# EAGLE schematic bluepill-knx-transceiver (EAGLE 9.0.1)
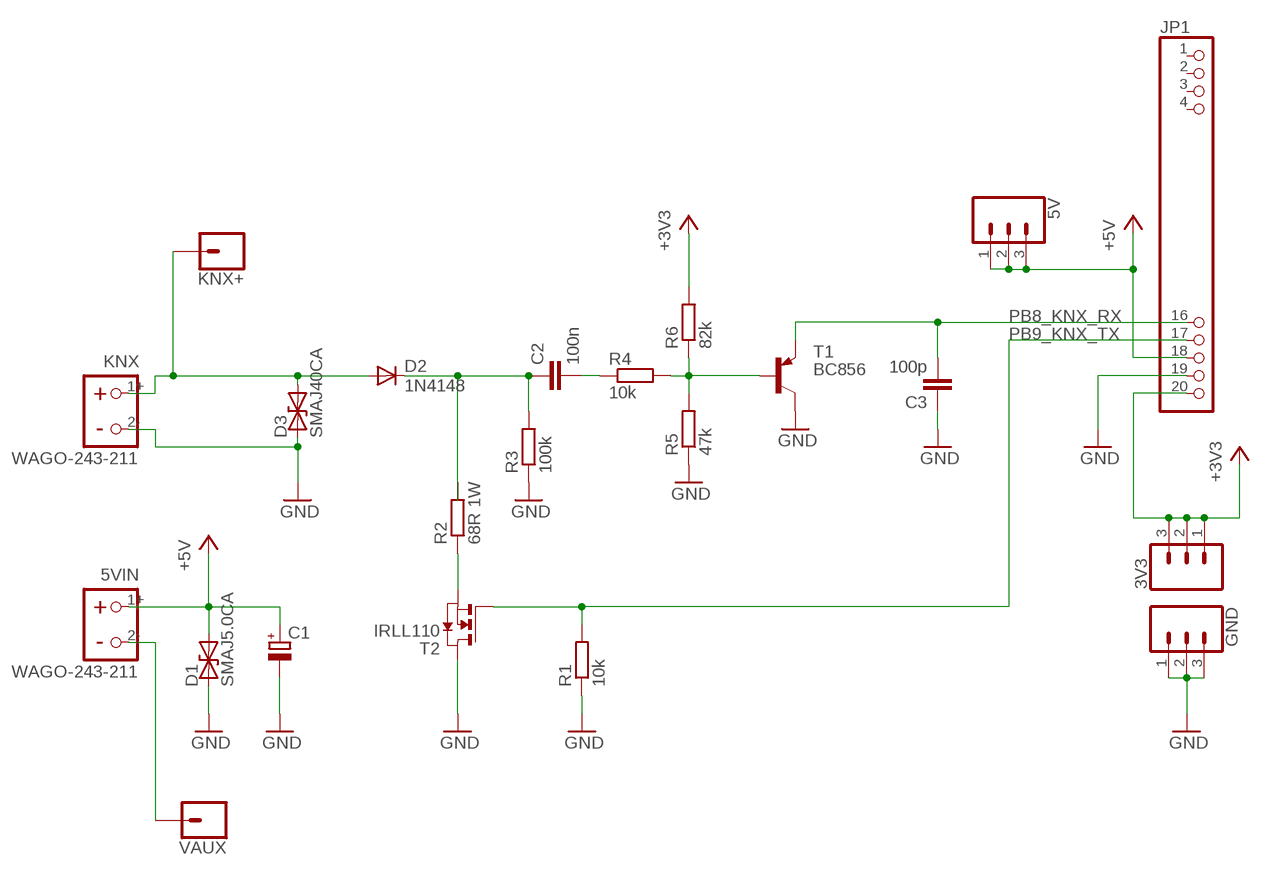
[diagram p0: schematic, sheet 1]

## Parts
3V3  CONN_03  [1X03]
5V  CONN_03  [1X03]
5VIN  WAGO-243-211  [WAGO-243-211]
C1  CPOL-EUE3.5-8  [E3,5-8]
C2  100n  C-EUC1206  [C1206]
C3  100p  C-EUC1206  [C1206]
D1  SMAJ5.0CA  SMAJ40AC  [DO-214AC]
D2  1N4148  DIODE-MINIMELF  [MINIMELF]
D3  SMAJ40CA  SMAJ40AC  [DO-214AC]
GND  CONN_03  [1X03]
JP1  PINHD-1X20-BP  [1X20-BP]
KNX  WAGO-243-211  [WAGO-243-211]
KNX+  CONN_01  [1X01]
R1  10k  R-EU_R1206  [R1206]
R2  68R 1W  R-EU_R2512  [R2512]
R3  100k  R-EU_R1206  [R1206]
R4  10k  R-EU_R1206  [R1206]
R5  47k  R-EU_R1206  [R1206]
R6  82k  R-EU_R1206  [R1206]
T1  BC856  BC856BSMD  [SOT23-BEC]
T2  IRLL110  NMOSSOT223  [SOT223]
VAUX  CONN_01  [1X01]

## Nets
5V: 5V.1 5V.2 5V.3 5VIN.1+ C1.+ D1.C JP1.18 ; supply symbol labelled +5V
+3V3: 3V3.1 3V3.2 3V3.3 JP1.20 R6.2
EIB+ [power]: D2.A D3.C KNX+.1 KNX.1+
GND: C1.- C3.1 D1.A D3.A GND.1 GND.2 GND.3 JP1.19 KNX.2- R1.1 R3.1 R5.1 T1.C T2.2(D) T2.4(D)
KNX+D: C2.1 D2.C R2.2 R3.2
N$1: C2.2 R4.1
N$2: R2.1 T2.3(S)
N$14: R4.2 R5.2 R6.1 T1.B
PB8_KNX_RX: C3.2 JP1.16 T1.E
PB9_KNX_TX: JP1.17 R1.2 T2.1(G)
VAUX: 5VIN.2- VAUX.1
Unconnected: JP1.1 JP1.2 JP1.3 JP1.4

## Library data of the parts
3V3 5V GND = SparkFun-Connectors:CONN_03: Multi connection point. Often used as Generic Header-pin footprint for 0.1 inch spaced/style header connections On any of the 0.1 inch spaced packages, you can populate with these: Break Away Headers - Straight <https://www.sparkfun.com/products/116> (PRT-00116) Break Away Male Headers - Right Angle <https://www.sparkfun.com/products/553> (PRT-00553) Female Headers <https://www.sparkfun.com/products/115> (PRT-00115) Break Away Headers - Machine Pin <https://www.sparkfun.com/products/117> (PRT-00117) Break Away Female Headers - Swiss Machine Pin <https://www.sparkfun.com/products/743> (PRT-00743) Stackable Header - 3 Pin (Female, 0.1") <https://www.sparkfun.com/products/13875> (PRT-13875) For SCREWTERMINALS and SPRING TERMINALS visit here: Screw Terimnals on SparkFun.com <https://www.sparkfun.com/search/results?term=Screw+Terminals> (5mm/3.5mm/2.54mm spacing) This device is also useful as a general connection point to wire up your design to another part of your project. Our various solder wires solder well into these plated through hole pads. Hook-Up Wire - Assortment (Stranded, 22 AWG) <https://www.sparkfun.com/products/11375> (PRT-11375) Hook-Up Wire - Assortment (Solid Core, 22 AWG) <https://www.sparkfun.com/products/11367> (PRT-11367) View the entire wire category on our website here <https://www.sparkfun.com/categories/141> Special notes: Molex polarized connector foot print use with SKU : PRT-08232 with associated crimp pins and housings.
5VIN KNX = Connector_for_Selfbus-Projects:WAGO-243-211: WAGO KNX-Busklemme
C1 = rcl:CPOL-EU: POLARIZED CAPACITOR, European symbol; SPICEPREFIX: C
C2 = rcl:C-EU: CAPACITOR, European symbol; REICHELT: X7R-G0805 100N
C3 = rcl:C-EU: CAPACITOR, European symbol; REICHELT: NPO-G0805 100P
D1 D3 = diode:SMAJ40AC
D2 = diode:DIODE-: DIODE; REICHELT: 1N 4148 SMD
JP1 = pinhead-1:PINHD-1X20-BP: PIN HEADER
KNX+ VAUX = SparkFun-Connectors:CONN_01: Single connection point. Often used as Generic Header-pin footprint for 0.1 inch spaced/style header connections On any of the 0.1 inch spaced packages, you can populate with these: Break Away Headers - Straight <https://www.sparkfun.com/products/116> (PRT-00116) Break Away Male Headers - Right Angle <https://www.sparkfun.com/products/553> (PRT-00553) Female Headers <https://www.sparkfun.com/products/115> (PRT-00115) Break Away Headers - Machine Pin <https://www.sparkfun.com/products/117> (PRT-00117) Break Away Female Headers - Swiss Machine Pin <https://www.sparkfun.com/products/743> (PRT-00743) This device is also useful as a general connection point to wire up your design to another part of your project. Our various solder wires solder well into these plated through hole pads. Hook-Up Wire - Assortment (Stranded, 22 AWG) <https://www.sparkfun.com/products/11375> (PRT-11375) Hook-Up Wire - Assortment (Solid Core, 22 AWG) <https://www.sparkfun.com/products/11367> (PRT-11367) View the entire wire category on our website here <https://www.sparkfun.com/categories/141> Special notes: SMTSO-256-ET is a "flush mount" nut for a 4-40 screw. We mostly use this on specialty testbeds; it is a nice way to connect hardware to your PCB at an adjustable hieght. Also note, the SNAP packages are for using a snappable style connector. We sell a baggie of snaps and they are also used on two LilyPad designs: Snap Assortment - 30 pack (male and female) <https://www.sparkfun.com/products/11347> (DEV-11347) LilyPad Arduino SimpleSnap <https://www.sparkfun.com/products/10941> (DEV-10941) LilyPad SimpleSnap Protoboard <https://www.sparkfun.com/products/10940> (DEV-10940)
R1 R5 = rcl:R-EU_: RESISTOR, European symbol; REICHELT: SMD-0805 47,0K
R2 = rcl:R-EU_: RESISTOR, European symbol; SPICEPREFIX: R
R3 = rcl:R-EU_: RESISTOR, European symbol; REICHELT: SMD-0805 100K
R4 = rcl:R-EU_: RESISTOR, European symbol; REICHELT: SMD-0805 10,0K
R6 = rcl:R-EU_: RESISTOR, European symbol; REICHELT: SMD-0805 82,0K
T1 = transistor-pnp:BC856*: PNP Transistror; REICHELT: BC 856B SMD
T2 = zetex:NMOSSOT223: MOS FET; OC_FARNELL: unknown; OC_NEWARK: unknown

## Net classes
1 power: width 0.305 mm